# Altium project Motor.PrjPcb
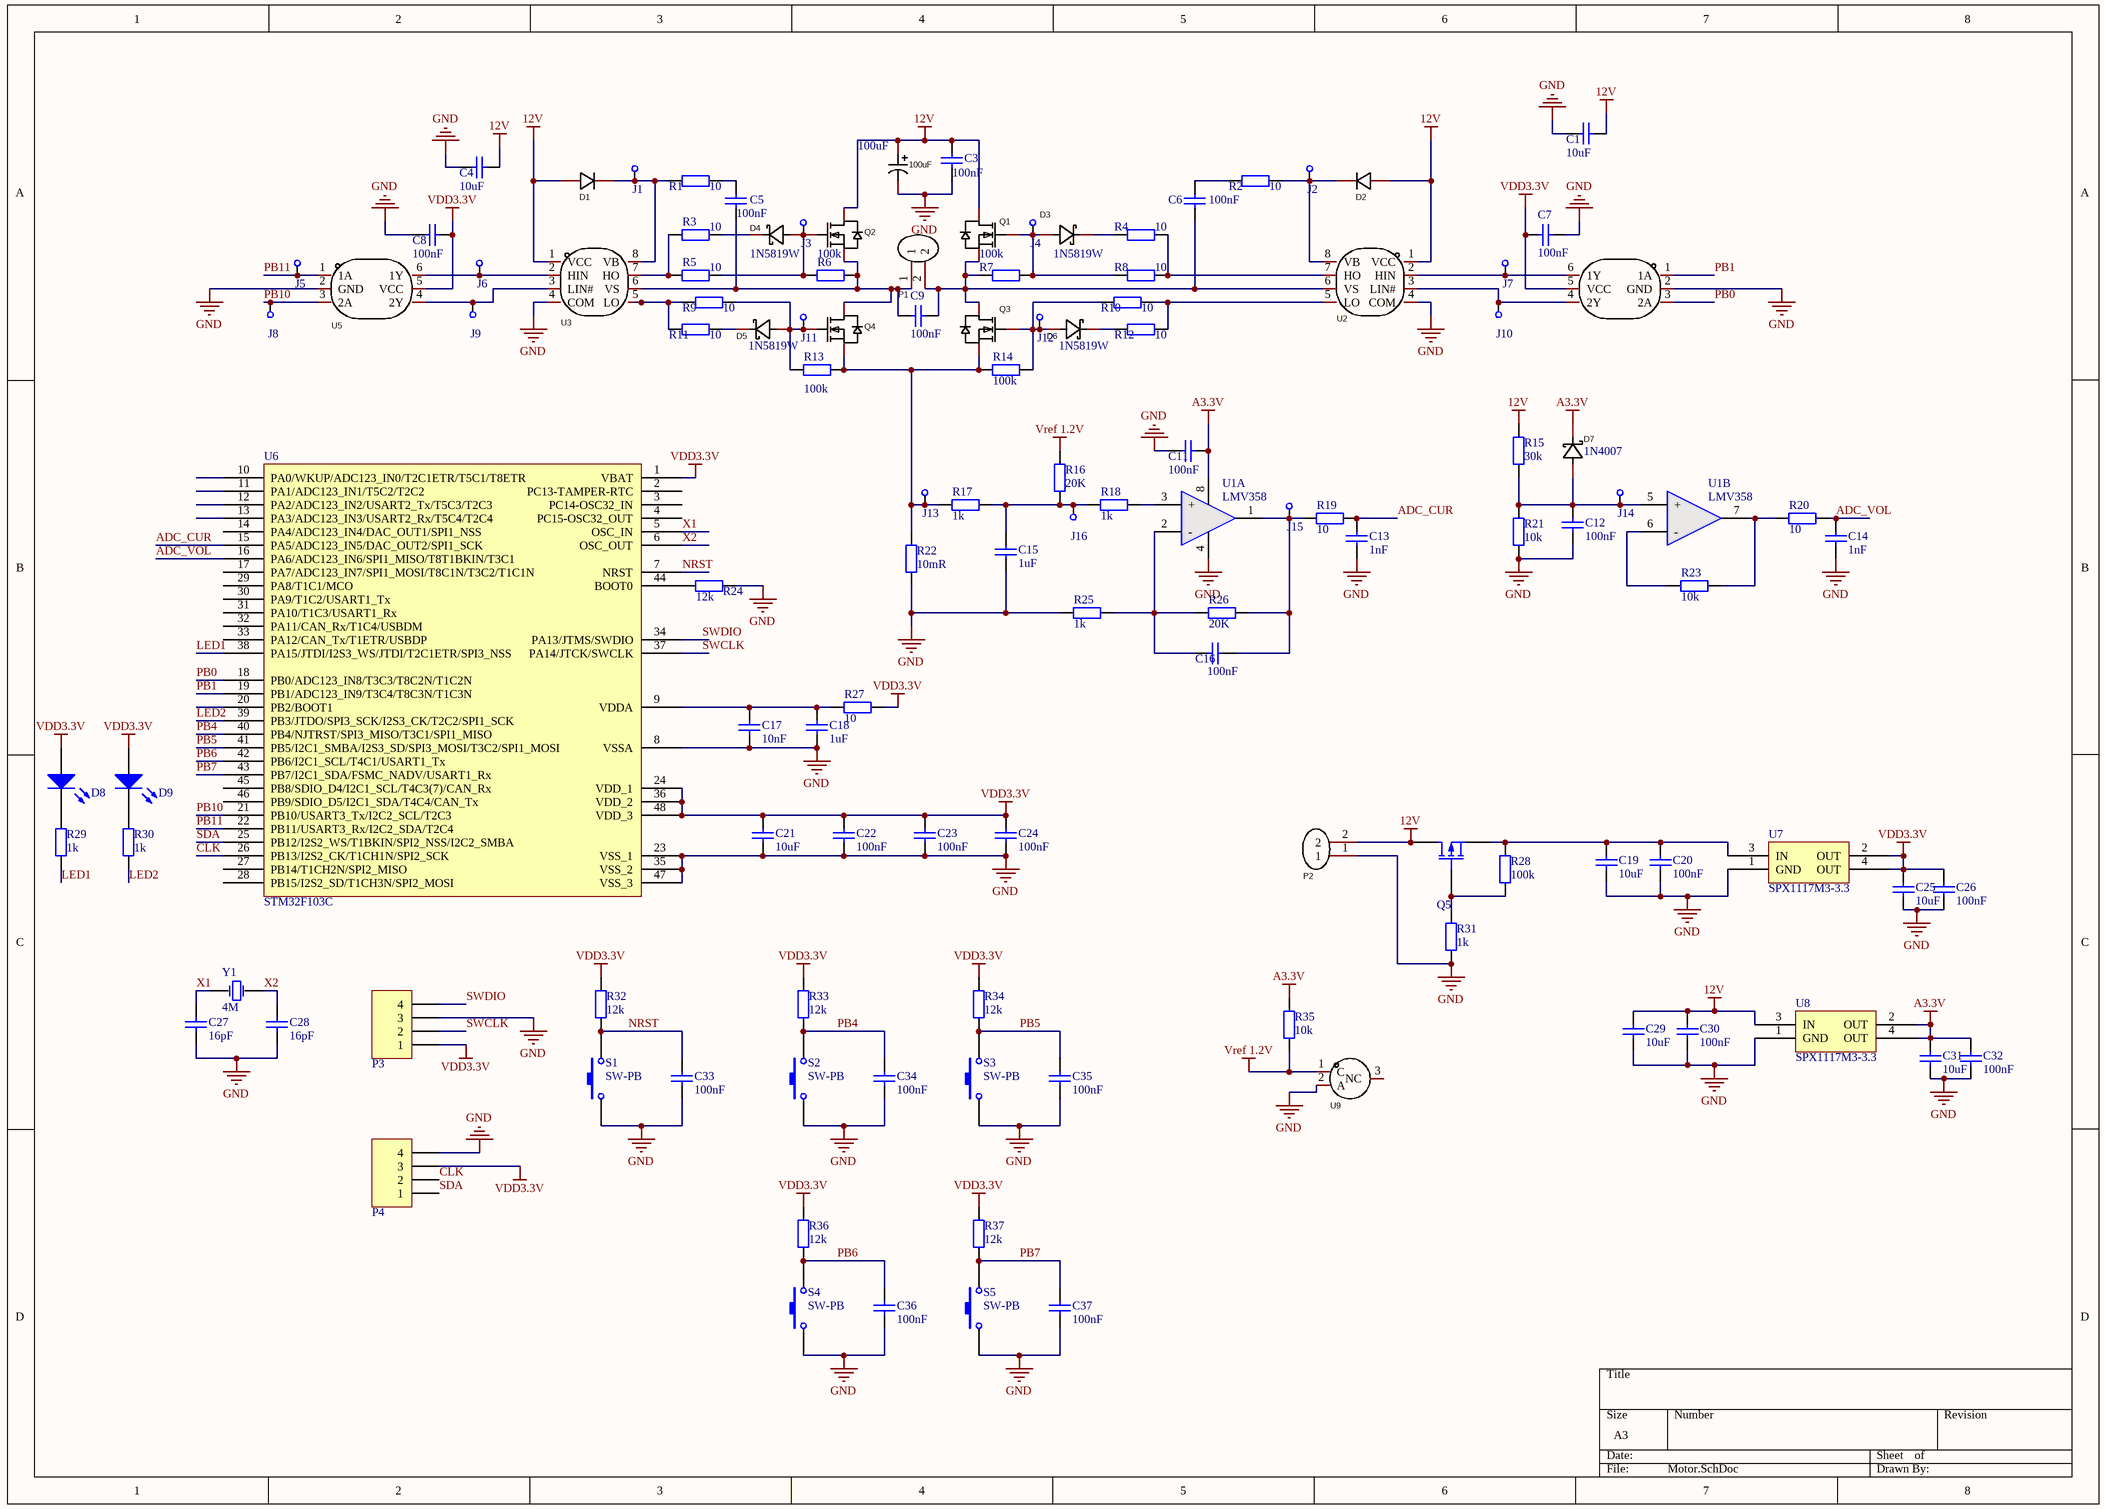
[diagram p0: Motor.SchDoc]
1 sheet, 122 parts. Net scope: global (net labels, ports and power ports of the same name join across sheets).
Board files: PCB1.PcbDoc, CAP-TH_BD5.0-P2.00-D0.5-FD-A.pcbdoc, HC-49UX-TH_L11.4-W4.7-P4.88.pcbdoc

## Sheet Motor.SchDoc
size A3; SheetNumber: 1; SheetTotal: 1

### Parts
C1  10uF  [C-RAD-0603]
C2  100uF  [CAP-TH_BD5.0-P2.00-D0.5-FD-A]
C3  100nF  [C-RAD-0603]
C4  10uF  [C-RAD-0603]
C5  100nF  [C-RAD-0603]
C6  100nF  [C-RAD-0603]
C7  100nF  [C-RAD-0603]
C8  100nF  [C-RAD-0603]
C9  100nF  [C-RAD-0603]
C11  100nF  [C-RAD-0603]
C12  100nF  [C-RAD-0603]
C13  1nF  [C-RAD-0603]
C14  1nF  [C-RAD-0603]
C15  1uF  [C-RAD-0603]
C16  100nF  [C-RAD-0603]
C17  10nF  [C-RAD-0603]
C18  1uF  [C-RAD-0603]
C19  10uF  [C-RAD-0603]
C20  100nF  [C-RAD-0603]
C21  10uF  [C-RAD-0603]
C22  100nF  [C-RAD-0603]
C23  100nF  [C-RAD-0603]
C24  100nF  [C-RAD-0603]
C25  10uF  [C-RAD-0603]
C26  100nF  [C-RAD-0603]
C27  16pF  [C-RAD-0603]
C28  16pF  [C-RAD-0603]
C29  10uF  [C-RAD-0603]
C30  100nF  [C-RAD-0603]
C31  10uF  [C-RAD-0603]
C32  100nF  [C-RAD-0603]
C33  100nF  [C-RAD-0603]
C34  100nF  [C-RAD-0603]
C35  100nF  [C-RAD-0603]
C36  100nF  [C-RAD-0603]
C37  100nF  [C-RAD-0603]
D1  1N4007WS  [SOD-323_L1.8-W1.3-LS2.5-RD]  (value not drawn)
D2  1N4007WS  [SOD-323_L1.8-W1.3-LS2.5-RD]  (value not drawn)
D3  1N5819W  [SOD-123_L2.7-W1.6-LS3.7-R-RD]
D4  1N5819W  [SOD-123_L2.7-W1.6-LS3.7-R-RD]
D5  1N5819W  [SOD-123_L2.7-W1.6-LS3.7-R-RD]
D6  1N5819W  [SOD-123_L2.7-W1.6-LS3.7-R-RD]
D7  1N4007  [SOD-123_L2.7-W1.6-LS3.7-R-RD]
D8  LED0  [LED_0805]  (value not drawn)
D9  LED0  [LED_0805]  (value not drawn)
J1  CHECK  [CHECK-A]  (value not drawn)
J2  CHECK  [CHECK-A]  (value not drawn)
J3  CHECK  [CHECK-A]  (value not drawn)
J4  CHECK  [CHECK-A]  (value not drawn)
J5  CHECK  [CHECK-A]  (value not drawn)
J6  CHECK  [CHECK-A]  (value not drawn)
J7  CHECK  [CHECK-A]  (value not drawn)
J8  CHECK  [CHECK-A]  (value not drawn)
J9  CHECK  [CHECK-A]  (value not drawn)
J10  CHECK  [CHECK-A]  (value not drawn)
J11  CHECK  [CHECK-A]  (value not drawn)
J12  CHECK  [CHECK-A]  (value not drawn)
J13  CHECK  [CHECK-A]  (value not drawn)
J14  CHECK  [CHECK-A]  (value not drawn)
J15  CHECK  [CHECK-A]  (value not drawn)
J16  CHECK  [CHECK-A]  (value not drawn)
P1  WJ500V-5.08-2P  [CONN-TH_2P-P5.00_WJ500V-5.08-2P]  (value not drawn)
P2  WJ500V-5.08-2P  [CONN-TH_2P-P5.00_WJ500V-5.08-2P]  (value not drawn)
P3  Header 4  [HDR4X1_A]  (value not drawn)
P4  Header 4  [HDR4X1_A]  (value not drawn)
Q1  NCE6020AK  [TO-252-2_L6.6-W6.1-P4.57-LS10.1-TL-CW]  (value not drawn)
Q2  NCE6020AK  [TO-252-2_L6.6-W6.1-P4.57-LS10.1-TL-CW]  (value not drawn)
Q3  NCE6020AK  [TO-252-2_L6.6-W6.1-P4.57-LS10.1-TL-CW]  (value not drawn)
Q4  NCE6020AK  [TO-252-2_L6.6-W6.1-P4.57-LS10.1-TL-CW]  (value not drawn)
Q5  MOSFET-P  [TO-220AB]  (value not drawn)
R1  10  [0603-1]
R2  10  [0603-1]
R3  10  [0603-1]
R4  10  [0603-1]
R5  10  [0603-1]
R6  100k  [0603-1]
R7  100k  [0603-1]
R8  10  [0603-1]
R9  10  [0603-1]
R10  10  [0603-1]
R11  10  [0603-1]
R12  10  [0603-1]
R13  100k  [0603-1]
R14  100k  [0603-1]
R15  30k  [0603-1]
R16  20K  [0603-1]
R17  1k  [0603-1]
R18  1k  [0603-1]
R19  10  [0603-1]
R20  10  [0603-1]
R21  10k  [0603-1]
R22  10mR  [2512]
R23  10k  [0603-1]
R24  12k  [0603-1]
R25  1k  [0603-1]
R26  20K  [0603-1]
R27  10  [0603-1]
R28  value 100k  [0603-1]  (hidden comment: 1k)
R29  1k  [0603-1]
R30  1k  [0603-1]
R31  1k  [0603-1]
R32  12k  [0603-1]
R33  12k  [0603-1]
R34  12k  [0603-1]
R35  10k  [0603-1]
R36  12k  [0603-1]
R37  12k  [0603-1]
S1  SW-PB  [SW_PB2_A1]
S2  SW-PB  [SW_PB2_A1]
S3  SW-PB  [SW_PB2_A1]
S4  SW-PB  [SW_PB2_A1]
S5  SW-PB  [SW_PB2_A1]
U1  LMV358  [NSO8_N]  (parts A,B of 2)
U2  XJNG2103  [SOIC-8_L4.9-W3.9-P1.27-LS6.0-BL]  (value not drawn)
U3  XJNG2103  [SOIC-8_L4.9-W3.9-P1.27-LS6.0-BL]  (value not drawn)
U4  SN74LVC2G17DBVR  [SOT-23-6_L2.9-W1.6-P0.95-LS2.8-BL]  (value not drawn)
U5  SN74LVC2G17DBVR  [SOT-23-6_L2.9-W1.6-P0.95-LS2.8-BL]  (value not drawn)
U6  STM32F103C  [LQFP-48_M]
U7  SPX1117M3-3.3  [SOT-223]
U8  SPX1117M3-3.3  [SOT-223]
U9  LM385M3-1.2/TR  [SOT-23-3_L2.9-W1.3-P1.90-LS2.4-BR]  (value not drawn)
Y1  value 4M  [HC-49UX-TH_L11.4-W4.7-P4.88]  (hidden comment: XTAL)

### Nets
12V: C1.1 C2.1 C3.2 C4.1 C29.2 C30.2 D1.2(A) D2.2(A) P2.2 Q1.2(D) Q2.2(D) Q5.D R15.1 U2.1(VCC) U3.1(VCC) U8.3(IN)
A3.3V: C11.1 C31.2 C32.2 D7.2(C) R35.2 U1.8(V+) U8.2(OUT) U8.4(OUT)
GND: C1.2 C2.2 C3.1 C4.2 C7.2 C8.2 C11.2 C12.2 C13.2 C14.2 C15.1 C17.1 C18.1 C19.1 C20.1 C21.1 C22.1 C23.1 C24.1 C25.1 C26.1 C27.1 C28.1 C29.1 C30.1 C31.1 C32.1 C33.1 C34.1 C35.1 C36.1 C37.1 P2.1 P3.3 P4.4 R21.2 R22.1 R24.2 R25.2 R31.1 S1.1 S2.1 S3.1 S4.1 S5.1 U1.4(V-) U2.4(COM) U3.4(COM) U4.2(GND) U5.2(GND) U6.8(VSSA) U6.23(VSS_1) U6.35(VSS_2) U6.47(VSS_3) U7.1(GND) U8.1(GND) U9.2(A)
VDD3.3V: C7.1 C8.1 C21.2 C22.2 C23.2 C24.2 C25.2 C26.2 D8.1(A) D9.1(A) P3.1 P4.3 R27.2 R32.2 R33.2 R34.2 R36.2 R37.2 U4.5(VCC) U5.5(VCC) U6.1(VBAT) U6.24(VDD_1) U6.36(VDD_2) U6.48(VDD_3) U7.2(OUT) U7.4(OUT)
Vref 1.2V: R16.1 R35.1 U9.1(C)
ADC_CUR: C13.1 R19.1 U6.15(PA5/ADC123_IN5/DAC_OUT2/SPI1_SCK)
ADC_VOL: C14.1 R20.1 U6.16(PA6/ADC123_IN6/SPI1_MISO/T8T1BKIN/T3C1)
CLK: P4.2 U6.26(PB13/I2S2_CK/T1CH1N/SPI2_SCK)
LED1: R29.1 U6.38(PA15/JTDI/I2S3_WS/JTDI/T2C1ETR/SPI3_NSS)
LED2: R30.1 U6.39(PB3/JTDO/SPI3_SCK/I2S3_CK/T2C2/SPI1_SCK)
NRST: C33.2 R32.1 S1.2 U6.7(NRST)
PB0: U4.3(2A) U6.18(PB0/ADC123_IN8/T3C3/T8C2N/T1C2N)
PB1: U4.1(1A) U6.19(PB1/ADC123_IN9/T3C4/T8C3N/T1C3N)
PB4: C34.2 R33.1 S2.2 U6.40(PB4/NJTRST/SPI3_MISO/T3C1/SPI1_MISO)
PB5: C35.2 R34.1 S3.2 U6.41(PB5/I2C1_SMBA/I2S3_SD/SPI3_MOSI/T3C2/SPI1_MOSI)
PB6: C36.2 R36.1 S4.2 U6.42(PB6/I2C1_SCL/T4C1/USART1_Tx)
PB7: C37.2 R37.1 S5.2 U6.43(PB7/I2C1_SDA/FSMC_NADV/USART1_Rx)
PB10: J8.1 U5.3(2A) U6.21(PB10/USART3_Tx/I2C2_SCL/T2C3)
PB11: J5.1 U5.1(1A) U6.22(PB11/USART3_Rx/I2C2_SDA/T2C4)
SDA: P4.1 U6.25(PB12/I2S2_WS/T1BKIN/SPI2_NSS/I2C2_SMBA)
SWCLK: P3.2 U6.37(PA14/JTCK/SWCLK)
SWDIO: P3.4 U6.34(PA13/JTMS/SWDIO)
X1: C27.2 U6.5(OSC_IN) Y1.2(OSC2)
X2: C28.2 U6.6(OSC_OUT) Y1.1(OSC1)
NetC5_1: C5.1 C9.2 P1.1 Q2.3(S) Q4.2(D) R6.2 U3.6(VS)
NetC5_2: C5.2 R1.1
NetC6_1: C6.1 C9.1 P1.2 Q1.3(S) Q3.2(D) R7.2 U2.6(VS)
NetC6_2: C6.2 R2.2
NetC12_1: C12.1 D7.1(A) J14.1 R15.2 R21.1 U1.5(+)
NetC15_2: C15.2 J16.1 R16.2 R17.1 R18.2
NetC16_1: C16.1 J15.1 R19.2 R26.1 U1.1(OUT1)
NetC16_2: C16.2 R25.1 R26.2 U1.2(-)
NetC17_2: C17.2 C18.2 R27.1 U6.9(VDDA)
NetC19_2: C19.2 C20.2 Q5.S R28.2 U7.3(IN)
NetD1_1: D1.1(K) J1.1 R1.2 U3.8(VB)
NetD2_1: D2.1(K) J2.1 R2.1 U2.8(VB)
NetD3_1: D3.1(A) J4.1 Q1.1(G) R7.1 R8.2
NetD3_2: D3.2(C) R4.2
NetD4_1: D4.1(A) J3.1 Q2.1(G) R5.2 R6.1
NetD4_2: D4.2(C) R3.2
NetD5_1: D5.1(A) J11.1 Q4.1(G) R9.2 R13.1
NetD5_2: D5.2(C) R11.2
NetD6_1: D6.1(A) J12.1 Q3.1(G) R10.2 R14.1
NetD6_2: D6.2(C) R12.2
NetD8_2: D8.2(K) R29.2
NetD9_2: D9.2(K) R30.2
NetJ6_1: J6.1 U3.2(HIN) U5.6(1Y)
NetJ7_1: J7.1 U2.2(HIN) U4.6(1Y)
NetJ9_1: J9.1 U3.3(LIN#) U5.4(2Y)
NetJ10_1: J10.1 U2.3(LIN#) U4.4(2Y)
NetJ13_1: J13.1 Q3.3(S) Q4.3(S) R13.2 R14.2 R17.2 R22.2
NetQ5_G: Q5.G R28.1 R31.2
NetR3_1: R3.1 R5.1 U3.7(HO)
NetR4_1: R4.1 R8.1 U2.7(HO)
NetR9_1: R9.1 R11.1 U3.5(LO)
NetR10_1: R10.1 R12.1 U2.5(LO)
NetR18_1: R18.1 U1.3(+)
NetR20_2: R20.2 R23.2 U1.7(OUT2)
NetR23_1: R23.1 U1.6(-)
NetR24_1: R24.1 U6.44(BOOT0)

Not connected (* = marked no-connect by the designer): U6 2(PC13-TAMPER-RTC) 3(PC14-OSC32_IN) 4(PC15-OSC32_OUT) 10(PA0/WKUP/ADC123_IN0/T2C1ETR/T5C1/T8ETR) 11(PA1/ADC123_IN1/T5C2/T2C2) 12(PA2/ADC123_IN2/USART2_Tx/T5C3/T2C3) 13(PA3/ADC123_IN3/USART2_Rx/T5C4/T2C4) 14(PA4/ADC123_IN4/DAC_OUT1/SPI1_NSS) 17(PA7/ADC123_IN7/SPI1_MOSI/T8C1N/T3C2/T1C1N) 20(PB2/BOOT1) 27(PB14/T1CH2N/SPI2_MISO) 28(PB15/I2S2_SD/T1CH3N/SPI2_MOSI) 29(PA8/T1C1/MCO) 30(PA9/T1C2/USART1_Tx) 31(PA10/T1C3/USART1_Rx) 32(PA11/CAN_Rx/T1C4/USBDM) 33(PA12/CAN_Tx/T1ETR/USBDP) 45(PB8/SDIO_D4/I2C1_SCL/T4C3(7)/CAN_Rx) 46(PB9/SDIO_D5/I2C1_SDA/T4C4/CAN_Tx); U9 3(NC)

### Library data of the parts
C1 C3-C9 C11-C37 = Cap: 无极性电容; Published: 8-Jun-2000; LatestRevisionDate: 17-Jul-2002; LatestRevisionNote: Re-released for DXP Platform.; PackageReference: RAD-0.3; Publisher: Altium Limited
  C1 C4 C19 C21 C25 C29 C31: Value: 10uF
  C3 C5-C9 C11 C12 C16 C20 C22-C24 C26 C30 C32-C37: Value: 100nF
  C13 C14: Value: 1nF
  C15 C18: Value: 1uF
  C17: Value: 10nF
  C27 C28: Value: 16pF
C2 = Cap_1: 贴片和直插电解电容; Manufacturer: KNSCHA(科尼盛); Symbol: RVT47UF50V67RV0029; Add into BOM: yes; Tolerance: ±20%; Rated Voltage: 50V; φD: 6.3mm; L: 7.7mm; Ripple Current: 66mA@120Hz; Lifetime @ Temp: 2000hrs@105℃; Capacitance: 47uF; Name: 100uF; Device: RVT47UF50V67RV0029; LCSC Part Name: 47uF ±20% 50V; Supplier Part: C2887275; Manufacturer Part: RVT47UF50V67RV0029; Supplier Footprint: SMD,D6.3xL7.7mm; JLCPCB Part Class: Extended Part; Datasheet: https://atta.szlcsc.com/upload/public/pdf/source/20210824/3B61B08E802BEB202F31F6CC5BD6B8B5.pdf; Supplier: LCSC; Convert to PCB: yes; Value: 100uF; Equivalent Series Resistance(ESR): -; Operating Temperature: -55℃~+105℃
D1 D2 = 1N4007WS: 二极管; Manufacturer: MDD; Add into BOM: yes; Name: 1N4007WS; Symbol: 1N4007WS; Device: 1N4007WS; LCSC Part Name: 1N4007WS; Supplier Part: C193404; Manufacturer Part: 1N4007WS; Supplier Footprint: SOD-323; JLCPCB Part Class: Extended Part; Datasheet: https://atta.szlcsc.com/upload/public/pdf/source/20180525/C193404_0C623596A90FA1D1FBDCFE625FBC3C97.pdf; Supplier: LCSC; Convert to PCB: yes
D3-D7 = 1N5819W: 二极管; Manufacturer: JSMSEMI(杰盛微); Symbol: 1N5819W_C963381; Add into BOM: yes; Diode Configuration: 独立式; Reverse Voltage (Vr): 40V; Average Rectified Current (Io): 350mA; Forward Voltage (Vf@If): 600mV@200mA; Reverse Leakage Current (Ir): 5uA@30V; Name: 1N5819W; Device: 1N5819W_C963381; LCSC Part Name: 40V 350mA 600mV@200mA; Supplier Part: C963381; Manufacturer Part: 1N5819W; Supplier Footprint: SOD-123; JLCPCB Part Class: Extended Part; Datasheet: https://atta.szlcsc.com/upload/public/pdf/source/20211201/C266112E93E924DFE0C071C9A8E85281.pdf; Supplier: LCSC; Convert to PCB: yes
D8 D9 = LED0: 发光二极管; Published: 8-Jun-2000; LatestRevisionDate: 08-Jul-2005; LatestRevisionNote: Mech Layer 1 removed.; PackageReference: LED-0; Publisher: Altium Limited
J1-J16 = CHECK: 测试点
P1 P2 = WJ500V-5.08-2P: 接线端子; Manufacturer: KANGNEX(康奈克斯电气); Symbol: WJ500V-5.08-2P-14-00A; Add into BOM: yes; Pitch: 5.08mm; Number of PINs Per Row: 2; Current Rating (Max): 18A; Voltage Rating (Max): 250V; Wire Gauge - AWG: 14~30; Wire Gauge - mm?: 2.5; Name: WJ500V-5.08-2P; Device: WJ500V-5.08-2P; LCSC Part Name: 5.08mm 排数:1 每排P数:2 直针 可拼接; Supplier Part: C8465; Manufacturer Part: WJ500V-5.08-2P; Supplier Footprint: 直插,P=5.08mm; JLCPCB Part Class: Extended Part; Datasheet: https://atta.szlcsc.com/upload/public/pdf/source/20191225/C8465_02D34CE5B5B4A53DF5891601D97FA9F4.pdf; Supplier: LCSC; Convert to PCB: yes; Number of Rows: 1; Mounting Style: 直针; Operating Temperature Range: -40℃~+105℃; Color: 绿色
P3 P4 = Header 4: 接插件; LatestRevisionDate: 17-Jul-2002; LatestRevisionNote: Re-released for DXP Platform.; Publisher: Altium Limited
Q1-Q4 = NCE6020AK: NMOS; Manufacturer: NCE(无锡新洁能); Add into BOM: yes; Type: N沟道; Drain Source Voltage (Vdss): 60V; Continuous Drain Current (Id): 20A; Power Dissipation (Pd): 45W; Drain Source On Resistance (RDS(on)@Vgs,Id): 35mΩ@10V,20A; Gate Threshold Voltage (Vgs(th)@Id): 2.5V@250uA; Name: NCE6020AK; Symbol: NCE6020AK; Device: NCE6020AK; LCSC Part Name: N沟道 60V 20A; Supplier Part: C108639; Manufacturer Part: NCE6020AK; Supplier Footprint: TO-252-2(DPAK); JLCPCB Part Class: Extended Part; Datasheet: https://atta.szlcsc.com/upload/public/pdf/source/20170508/1494211006052.pdf; Supplier: LCSC; Convert to PCB: yes
Q5 = MOSFET-P: P-Channel MOSFET; PackageDocument: 1995/1996; Published: 8-Jun-2000; LatestRevisionDate: 17-Jul-2002; LatestRevisionNote: Re-released for DXP Platform.; PackageReference: E3; Publisher: Altium Limited
R1-R37 = Res1: 贴片电阻; Published: 8-Jun-2000; LatestRevisionDate: 17-Jul-2002; LatestRevisionNote: Re-released for DXP Platform.; PackageReference: AXIAL-0.4; Publisher: Altium Limited
  R1-R5 R8-R12 R19 R20 R27: Value: 10
  R6 R7 R13 R14: Value: 100k
  R15: Value: 30k
  R16 R26: Value: 20K
  R17 R18 R25 R29-R31: Value: 1k
  R21 R23 R35: Value: 10k
  R22: Value: 10mR
  R24 R32-R34 R36 R37: Value: 12k
S1-S5 = SW-PB: 微动开关; Published: 24-Mar-1999; LatestRevisionDate: 17-Jul-2002; LatestRevisionNote: Re-released for DXP Platform.; PackageReference: SPST-2; Publisher: Altium Limited
U1 = LM358: 双运放
U2 U3 = XJNG2103: MOS驱动; Manufacturer: NCE(无锡新洁能); Add into BOM: yes; Driven Configuration: 半桥; Number of Drivers: 2; loadtype: MOSFET; Whether the isolation: 非隔离; Supply Voltage: 6V~20V; Rise Time: 50ns; Fall Time: 40ns; Name: XJNG2103; Symbol: XJNG2103; Device: XJNG2103; LCSC Part Name: 半桥 MOSFET; Supplier Part: C2887735; Manufacturer Part: XJNG2103; Supplier Footprint: SOIC-8; JLCPCB Part Class: Extended Part; Datasheet: https://atta.szlcsc.com/upload/public/pdf/source/20210824/2661D35F843708EC116D5340AB29615E.pdf; Supplier: LCSC; Convert to PCB: yes; Peak Output Current(sink): -; Peak Output Current(source): -; Propagation Delay tpLH: -; Propagation Delay tpHL: -; Feature: -; Operating Temperature: -55℃~+150℃@(Tj)
U4 U5 = SN74LVC2G17DBVR: 缓冲器; Manufacturer: TI(德州仪器); Add into BOM: yes; Logic Family: 74LVC; Number of Elements: 2; Number of Bits per Element: 1; Supply Voltage: 1.65V~5.5V; Input type: 施密特触发器; output type: 推挽; Sink Current: 32mA; Name: SN74LVC2G17DBVR; Symbol: SN74LVC2G17DBVR; Device: SN74LVC2G17DBVR; LCSC Part Name: SN74LVC2G17DBVR; Supplier Part: C10429; Manufacturer Part: SN74LVC2G17DBVR; Supplier Footprint: SOT-23-6; JLCPCB Part Class: Extended Part; Datasheet: https://www.ti.com/cn/lit/gpn/sn74lvc2g17; Supplier: LCSC; Convert to PCB: yes; Channel Type: -; Source Current: 32mA; Operating Temperature: -40℃~+125℃
U6 = STM32F103C: STM32单片机48引脚
U7 U8 = SPX1117M3-3.3: 3.3V稳压芯片
U9 = LM385M3-1.2/TR: Manufacturer: HGSEMI(华冠); Add into BOM: yes; Symbol: LM385M3-1.2/TR; Device: LM385M3-1.2/TR; LCSC Part Name: 1.2V 微功耗电压参考; Supplier Part: C507206; Manufacturer Part: LM385M3-1.2/TR; Supplier Footprint: SOT-23-3; JLCPCB Part Class: Extended Part; Datasheet: https://atta.szlcsc.com/upload/public/pdf/source/20200716/C507206_69C34F3D5BBAED8E3BE132CB46276FD0.pdf; Supplier: LCSC; Convert to PCB: yes
Y1 = XTAL: 晶振; Published: 8-Jun-2000; LatestRevisionDate: 17-Jul-2002; LatestRevisionNote: Re-released for DXP Platform.; PackageReference: R38; Publisher: Altium Limited